# Altium schematic sheet 10scm153adp1_io.SchDoc
size A3; DocumentNumber: 2; SheetNumber: 2; SheetTotal: 3
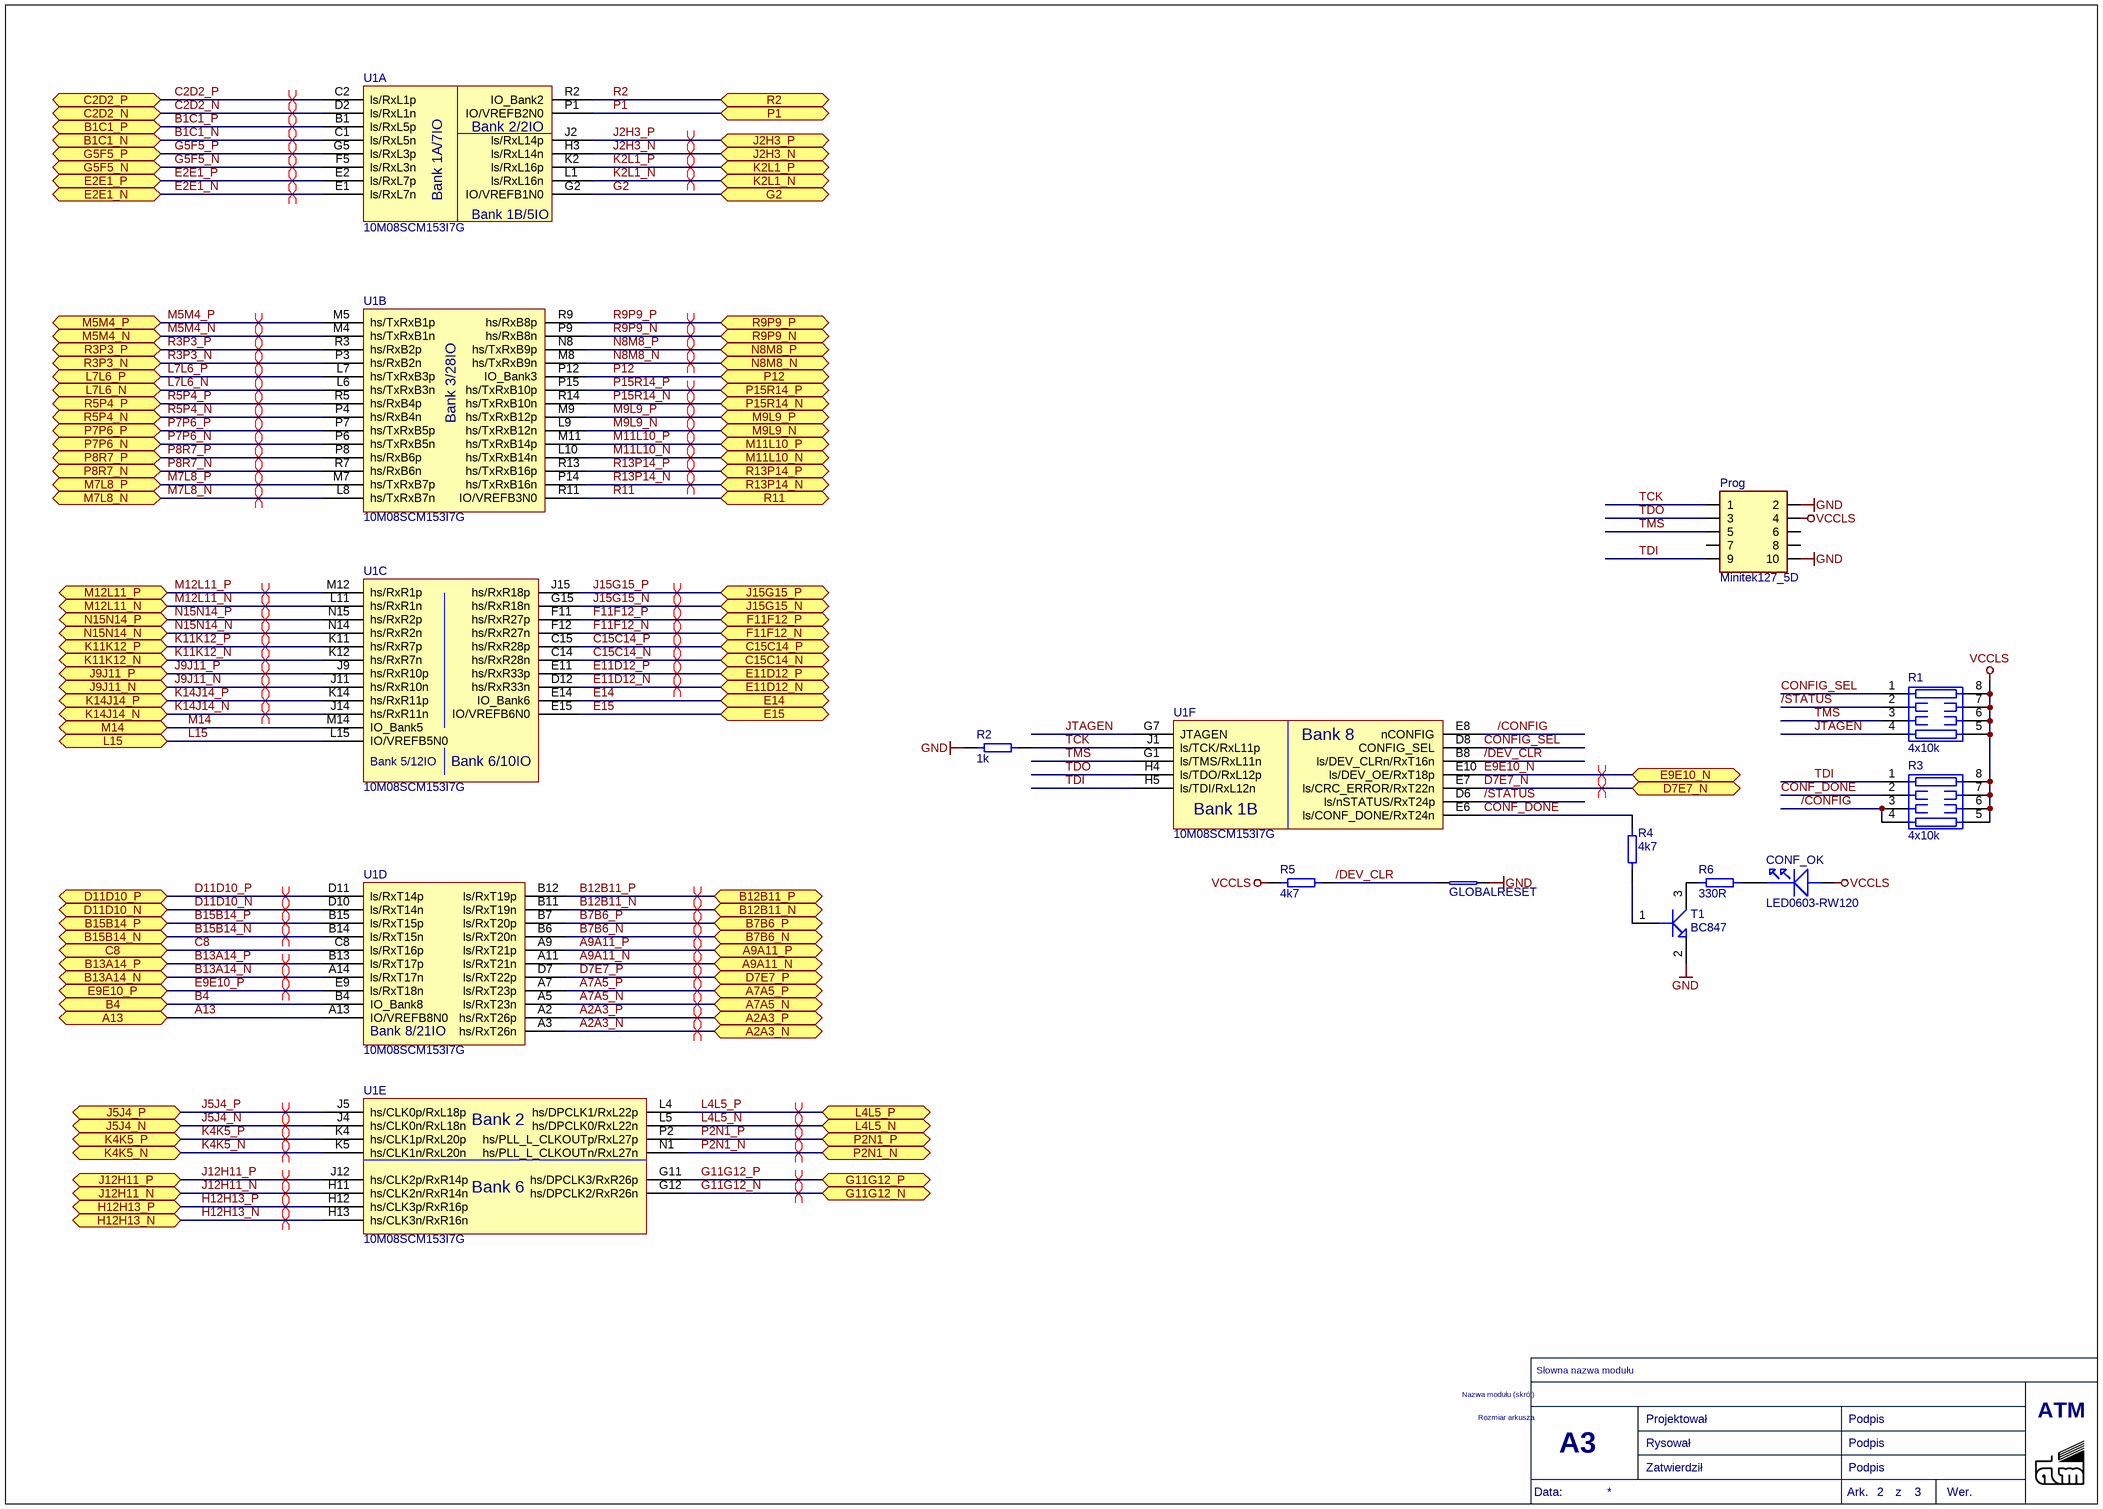
[diagram p0: 10scm153adp1_io.SchDoc]

## Parts
CONF_OK  LED0603-RW120  [D0603]
GLOBALRESET  SHORT0805  [SHORT0805]  (value not drawn)
Prog  Minitek127_5D  [MINITEK127_5D]
R1  4x10k  [1206RP]
R2  1k  [0603R]
R3  4x10k  [1206RP]
R4  4k7  [0603R]
R5  4k7  [0603R]
R6  330R  [0603R]
T1  BC847  [SOT23-3]
U1  10M08SCM153I7G  [MBGA153x15]  (parts A,B,C,D,E,F of 8)

## Ports
A2A3_N (bidir), A2A3_P (bidir), A7A5_N (bidir), A7A5_P (bidir), A9A11_N (bidir), A9A11_P (bidir), A13 (bidir), B1C1_N (bidir), B1C1_P (bidir), B4 (bidir), B7B6_N (bidir), B7B6_P (bidir), B12B11_N (bidir), B12B11_P (bidir), B13A14_N (bidir), B13A14_P (bidir), B15B14_N (bidir), B15B14_P (bidir), C2D2_N (bidir), C2D2_P (bidir), C8 (bidir), C15C14_N (bidir), C15C14_P (bidir), D7E7_N (bidir), D7E7_P (bidir), D11D10_N (bidir), D11D10_P (bidir), E2E1_N (bidir), E2E1_P (bidir), E9E10_N (bidir), E9E10_P (bidir), E11D12_N (bidir), E11D12_P (bidir), E14 (bidir), E15 (bidir), F11F12_N (bidir), F11F12_P (bidir), G2 (bidir), G5F5_N (bidir), G5F5_P (bidir), G11G12_N (bidir), G11G12_P (bidir), H12H13_N (bidir), H12H13_P (bidir), J2H3_N (bidir), J2H3_P (bidir), J5J4_N (bidir), J5J4_P (bidir), J9J11_N (bidir), J9J11_P (bidir), J12H11_N (bidir), J12H11_P (bidir), J15G15_N (bidir), J15G15_P (bidir), K2L1_N (bidir), K2L1_P (bidir), K4K5_N (bidir), K4K5_P (bidir), K11K12_N (bidir), K11K12_P (bidir), K14J14_N (bidir), K14J14_P (bidir), L4L5_N (bidir), L4L5_P (bidir), L7L6_N (bidir), L7L6_P (bidir), L15 (bidir), M5M4_N (bidir), M5M4_P (bidir), M7L8_N (bidir), M7L8_P (bidir), M9L9_N (bidir), M9L9_P (bidir), M11L10_N (bidir), M11L10_P (bidir), M12L11_N (bidir), M12L11_P (bidir), M14 (bidir), N8M8_N (bidir), N8M8_P (bidir), N15N14_N (bidir), N15N14_P (bidir), P1 (bidir), P2N1_N (bidir), P2N1_P (bidir), P7P6_N (bidir), P7P6_P (bidir), P8R7_N (bidir), P8R7_P (bidir), P12 (bidir), P15R14_N (bidir), P15R14_P (bidir), R2 (bidir), R3P3_N (bidir), R3P3_P (bidir), R5P4_N (bidir), R5P4_P (bidir), R9P9_N (bidir), R9P9_P (bidir), R11 (bidir), R13P14_N (bidir), R13P14_P (bidir)

## Nets
GND: GLOBALRESET.2 Prog.2 Prog.10 R2.1 T1.2
VCCLS: CONF_OK.ANOD Prog.4 R1.5(R5) R1.6(R6) R1.7(R7) R1.8(R8) R3.5(R5) R3.6(R6) R3.7(R7) R3.8(R8) R5.2
/CONFIG: R3.3(R3) R3.4(R4) U1.E8(nCONFIG)
/DEV_CLR: GLOBALRESET.1 R5.1 U1.B8(ls/DEV_CLRn/RxT16n)
/STATUS: R1.2(R2) U1.D6(ls/nSTATUS/RxT24p)
A2A3_N: U1.A3(hs/RxT26n) ; port A2A3_N
A2A3_P: U1.A2(hs/RxT26p) ; port A2A3_P
A7A5_N: U1.A5(ls/RxT23n) ; port A7A5_N
A7A5_P: U1.A7(ls/RxT23p) ; port A7A5_P
A9A11_N: U1.A11(ls/RxT21n) ; port A9A11_N
A9A11_P: U1.A9(ls/RxT21p) ; port A9A11_P
A13: U1.A13(IO/VREFB8N0) ; port A13
B1C1_N: U1.C1(ls/RxL5n) ; port B1C1_N
B1C1_P: U1.B1(ls/RxL5p) ; port B1C1_P
B4: U1.B4(IO_Bank8) ; port B4
B7B6_N: U1.B6(ls/RxT20n) ; port B7B6_N
B7B6_P: U1.B7(ls/RxT20p) ; port B7B6_P
B12B11_N: U1.B11(ls/RxT19n) ; port B12B11_N
B12B11_P: U1.B12(ls/RxT19p) ; port B12B11_P
B13A14_N: U1.A14(ls/RxT17n) ; port B13A14_N
B13A14_P: U1.B13(ls/RxT17p) ; port B13A14_P
B15B14_N: U1.B14(ls/RxT15n) ; port B15B14_N
B15B14_P: U1.B15(ls/RxT15p) ; port B15B14_P
C2D2_N: U1.D2(ls/RxL1n) ; port C2D2_N
C2D2_P: U1.C2(ls/RxL1p) ; port C2D2_P
C8: U1.C8(ls/RxT16p) ; port C8
C15C14_N: U1.C14(hs/RxR28n) ; port C15C14_N
C15C14_P: U1.C15(hs/RxR28p) ; port C15C14_P
CONF_DONE: R3.2(R2) R4.1 U1.E6(ls/CONF_DONE/RxT24n)
CONFIG_SEL: R1.1(R1) U1.D8(CONFIG_SEL)
D7E7_N: U1.E7(ls/CRC_ERROR/RxT22n) ; port D7E7_N
D7E7_P: U1.D7(ls/RxT22p) ; port D7E7_P
D11D10_N: U1.D10(ls/RxT14n) ; port D11D10_N
D11D10_P: U1.D11(ls/RxT14p) ; port D11D10_P
E2E1_N: U1.E1(ls/RxL7n) ; port E2E1_N
E2E1_P: U1.E2(ls/RxL7p) ; port E2E1_P
E9E10_N: U1.E10(ls/DEV_OE/RxT18p) ; port E9E10_N
E9E10_P: U1.E9(ls/RxT18n) ; port E9E10_P
E11D12_N: U1.D12(hs/RxR33n) ; port E11D12_N
E11D12_P: U1.E11(hs/RxR33p) ; port E11D12_P
E14: U1.E14(IO_Bank6) ; port E14
E15: U1.E15(IO/VREFB6N0) ; port E15
F11F12_N: U1.F12(hs/RxR27n) ; port F11F12_N
F11F12_P: U1.F11(hs/RxR27p) ; port F11F12_P
G2: U1.G2(IO/VREFB1N0) ; port G2
G5F5_N: U1.F5(ls/RxL3n) ; port G5F5_N
G5F5_P: U1.G5(ls/RxL3p) ; port G5F5_P
G11G12_N: U1.G12(hs/DPCLK2/RxR26n) ; port G11G12_N
G11G12_P: U1.G11(hs/DPCLK3/RxR26p) ; port G11G12_P
H12H13_N: U1.H13(hs/CLK3n/RxR16n) ; port H12H13_N
H12H13_P: U1.H12(hs/CLK3p/RxR16p) ; port H12H13_P
J2H3_N: U1.H3(ls/RxL14n) ; port J2H3_N
J2H3_P: U1.J2(ls/RxL14p) ; port J2H3_P
J5J4_N: U1.J4(hs/CLK0n/RxL18n) ; port J5J4_N
J5J4_P: U1.J5(hs/CLK0p/RxL18p) ; port J5J4_P
J9J11_N: U1.J11(hs/RxR10n) ; port J9J11_N
J9J11_P: U1.J9(hs/RxR10p) ; port J9J11_P
J12H11_N: U1.H11(hs/CLK2n/RxR14n) ; port J12H11_N
J12H11_P: U1.J12(hs/CLK2p/RxR14p) ; port J12H11_P
J15G15_N: U1.G15(hs/RxR18n) ; port J15G15_N
J15G15_P: U1.J15(hs/RxR18p) ; port J15G15_P
JTAGEN: R1.4(R4) U1.G7(JTAGEN)
K2L1_N: U1.L1(ls/RxL16n) ; port K2L1_N
K2L1_P: U1.K2(ls/RxL16p) ; port K2L1_P
K4K5_N: U1.K5(hs/CLK1n/RxL20n) ; port K4K5_N
K4K5_P: U1.K4(hs/CLK1p/RxL20p) ; port K4K5_P
K11K12_N: U1.K12(hs/RxR7n) ; port K11K12_N
K11K12_P: U1.K11(hs/RxR7p) ; port K11K12_P
K14J14_N: U1.J14(hs/RxR11n) ; port K14J14_N
K14J14_P: U1.K14(hs/RxR11p) ; port K14J14_P
L4L5_N: U1.L5(hs/DPCLK0/RxL22n) ; port L4L5_N
L4L5_P: U1.L4(hs/DPCLK1/RxL22p) ; port L4L5_P
L7L6_N: U1.L6(hs/TxRxB3n) ; port L7L6_N
L7L6_P: U1.L7(hs/TxRxB3p) ; port L7L6_P
L15: U1.L15(IO/VREFB5N0) ; port L15
M5M4_N: U1.M4(hs/TxRxB1n) ; port M5M4_N
M5M4_P: U1.M5(hs/TxRxB1p) ; port M5M4_P
M7L8_N: U1.L8(hs/TxRxB7n) ; port M7L8_N
M7L8_P: U1.M7(hs/TxRxB7p) ; port M7L8_P
M9L9_N: U1.L9(hs/TxRxB12n) ; port M9L9_N
M9L9_P: U1.M9(hs/TxRxB12p) ; port M9L9_P
M11L10_N: U1.L10(hs/TxRxB14n) ; port M11L10_N
M11L10_P: U1.M11(hs/TxRxB14p) ; port M11L10_P
M12L11_N: U1.L11(hs/RxR1n) ; port M12L11_N
M12L11_P: U1.M12(hs/RxR1p) ; port M12L11_P
M14: U1.M14(IO_Bank5) ; port M14
N8M8_N: U1.M8(hs/TxRxB9n) ; port N8M8_N
N8M8_P: U1.N8(hs/TxRxB9p) ; port N8M8_P
N15N14_N: U1.N14(hs/RxR2n) ; port N15N14_N
N15N14_P: U1.N15(hs/RxR2p) ; port N15N14_P
P1: U1.P1(IO/VREFB2N0) ; port P1
P2N1_N: U1.N1(hs/PLL_L_CLKOUTn/RxL27n) ; port P2N1_N
P2N1_P: U1.P2(hs/PLL_L_CLKOUTp/RxL27p) ; port P2N1_P
P7P6_N: U1.P6(hs/TxRxB5n) ; port P7P6_N
P7P6_P: U1.P7(hs/TxRxB5p) ; port P7P6_P
P8R7_N: U1.R7(hs/RxB6n) ; port P8R7_N
P8R7_P: U1.P8(hs/RxB6p) ; port P8R7_P
P12: U1.P12(IO_Bank3) ; port P12
P15R14_N: U1.R14(hs/TxRxB10n) ; port P15R14_N
P15R14_P: U1.P15(hs/TxRxB10p) ; port P15R14_P
R2: U1.R2(IO_Bank2) ; port R2
R3P3_N: U1.P3(hs/RxB2n) ; port R3P3_N
R3P3_P: U1.R3(hs/RxB2p) ; port R3P3_P
R5P4_N: U1.P4(hs/RxB4n) ; port R5P4_N
R5P4_P: U1.R5(hs/RxB4p) ; port R5P4_P
R9P9_N: U1.P9(hs/RxB8n) ; port R9P9_N
R9P9_P: U1.R9(hs/RxB8p) ; port R9P9_P
R11: U1.R11(IO/VREFB3N0) ; port R11
R13P14_N: U1.P14(hs/TxRxB16n) ; port R13P14_N
R13P14_P: U1.R13(hs/TxRxB16p) ; port R13P14_P
TCK: Prog.1 R2.2 U1.J1(ls/TCK/RxL11p)
TDI: Prog.9 R3.1(R1) U1.H5(ls/TDI/RxL12n)
TDO: Prog.3 U1.H4(ls/TDO/RxL12p)
TMS: Prog.5 R1.3(R3) U1.G1(ls/TMS/RxL11n)
NetCONF_OK_CATH: CONF_OK.CATH R6.2
NetR4_2: R4.2 T1.1
NetR6_1: R6.1 T1.3

Not connected (* = marked no-connect by the designer): Prog 6 7 8

## Layout directives
differential pair: A2A3_N, A2A3_P, A7A5_N, A7A5_P, A9A11_N, A9A11_P, B1C1_N, B1C1_P, B7B6_N, B7B6_P, B12B11_N, B12B11_P, B13A14_N, B13A14_P, B15B14_N, B15B14_P, C2D2_N, C2D2_P, C15C14_N, C15C14_P, D7E7_N, D7E7_P, D11D10_N, D11D10_P, E2E1_N, E2E1_P, E9E10_N, E9E10_P, E11D12_N, E11D12_P, F11F12_N, F11F12_P, G5F5_N, G5F5_P, G11G12_N, G11G12_P, H12H13_N, H12H13_P, J2H3_N, J2H3_P, J5J4_N, J5J4_P, J9J11_N, J9J11_P, J12H11_N, J12H11_P, J15G15_N, J15G15_P, K2L1_N, K2L1_P, K4K5_N, K4K5_P, K11K12_N, K11K12_P, K14J14_N, K14J14_P, L4L5_N, L4L5_P, L7L6_N, L7L6_P, M5M4_N, M5M4_P, M7L8_N, M7L8_P, M9L9_N, M9L9_P, M11L10_N, M11L10_P, M12L11_N, M12L11_P, N8M8_N, N8M8_P, N15N14_N, N15N14_P, P2N1_N, P2N1_P, P7P6_N, P7P6_P, P8R7_N, P8R7_P, P15R14_N, P15R14_P, R3P3_N, R3P3_P, R5P4_N, R5P4_P, R9P9_N, R9P9_P, R13P14_N, R13P14_P

## Notes on the sheet
- Nazwa modułu (skrót)
- Słowna nazwa modułu
- Rozmiar arkusza
- A3
- Zatwierdził
- Projektował
- Rysował
- Podpis
- ATM
- Data:
- Ark.
- z
- Wer.
- (in symbol ICs341, part A) Bank 2/2IO; Bank 1A/7IO; Bank 1B/5IO
- (in symbol ICs341, part B) Bank 3/28IO
- (in symbol ICs341, part C) Bank 5/12IO; Bank 6/10IO
- (in symbol ICs341, part D) Bank 8/21IO
- (in symbol ICs341, part E) Bank 2; Bank 6
- (in symbol ICs341, part F) Bank 8; Bank 1B

## Library data of the parts
CONF_OK = Opt25: Kod: Opt25; ID: 25; Descript: Dioda LED, SMD 0603, Czerwona 626-636nm, 50-70 mCd /10mA, water clear, 120°; Value: LED0603-RW120; Price5: 0,12; DateOfPrice5: 10-05-2020; Supplier5: maritex.com.pl; Reference5: LED0603-RW120; Manufacturer5: Honglitronic; Typ5: LED0603-RW120
GLOBALRESET = Res238: Kod: Res238; ID: 238; Descript: Przewlekana zwora z drutu na planie rezystora 0805; Value: SHORT0805; Price5: 0,1; Supplier5: -; Reference5: -; Manufacturer5: -; Typ5: -
Prog = CON83: Kod: CON83; ID: 83; Descript: Gniazdo; IDC; Minitek127; męskie; PIN: 10; pionowe; 1,27mm; SMT; 2x5; Reference5: 20021221-00010C4LF; Replacement: bd; Value: Minitek127_5D; Price5: 3,5; DateOfPrice5: 29-12-2020; Supplier5: tme; Manufacturer5: Amphenol; Typ5: 20021221-00010C4LF
R1 R3 = Res287: Kod: Res287; ID: 287; Descript: Drabinka rezystorowa: Y; 10kΩ; SMD; 1206; Il.rezystorów: 4; 63mW; Reference5: DR1206-10K-4/8; Typ5: 4D03WGJ0103T5E; Value: 4x10k; Price5: 0,1; DateOfPrice5: 29-12-2020; Supplier5: tme; Manufacturer5: Royal Ohm
R2 = Res52: Kod: Res52; ID: 52; Descript: Rezystor: thick film; SMD; 0603; 1kom; 0,1W; ±1%; -55÷155°C; Reference5: SMD0603-1K-1%; Typ5: 0603SAF1001T5E; Value: 1k; Price5: 0,08; DateOfPrice5: 10-05-2020; Supplier5: tme.pl; Manufacturer5: Royal Ohm
R4 R5 = Res171: Kod: Res171; ID: 171; Descript: Rezystor: thick film; SMD; 0603; 4,7kom; 0,1W; ±1%; -55÷125°C; Reference5: SMD0603-4K7-1%; Typ5: 0603SAF4701T5E; Value: 4k7; Price5: 0,1; DateOfPrice5: 25-06-2020; Supplier5: tme.pl; Manufacturer5: Royal Ohm
R6 = Res127: Kod: Res127; ID: 127; Descript: Rezystor: thick film; SMD; 0603; 330Ω; 0,1W; ±1%; -55÷125°C; Reference5: SMD0603-330R-1%; Typ5: 0603SAF3300T5E; Value: 330R; Price5: 0,1; DateOfPrice5: 25-06-2020; Supplier5: tme.pl; Manufacturer5: Royal Ohm
T1 = Tra11: Kod: Tra11; ID: 11; Descript: SMD transistor 50V 0.1A; Reference5: BC847A.215; Value: BC847; Price5: 0; DateOfPrice5: 01-01-2010; Supplier5: tme.pl; Manufacturer5: NXP; Typ5: BC847A.215
U1 = ICs341: Kod: ICs341; ID: 341; Descript: FPGA - Field Programmable Gate Array non-volatile FPGA, 112 I/O, 153MBGA; Reference5: 989-10M08SCM153I7G; Value: 10M08SCM153I7G; Price5: 100; DateOfPrice5: 29-12-2020; Supplier5: Mouser; Manufacturer5: Intel; Typ5: 10M08SCM153I7G